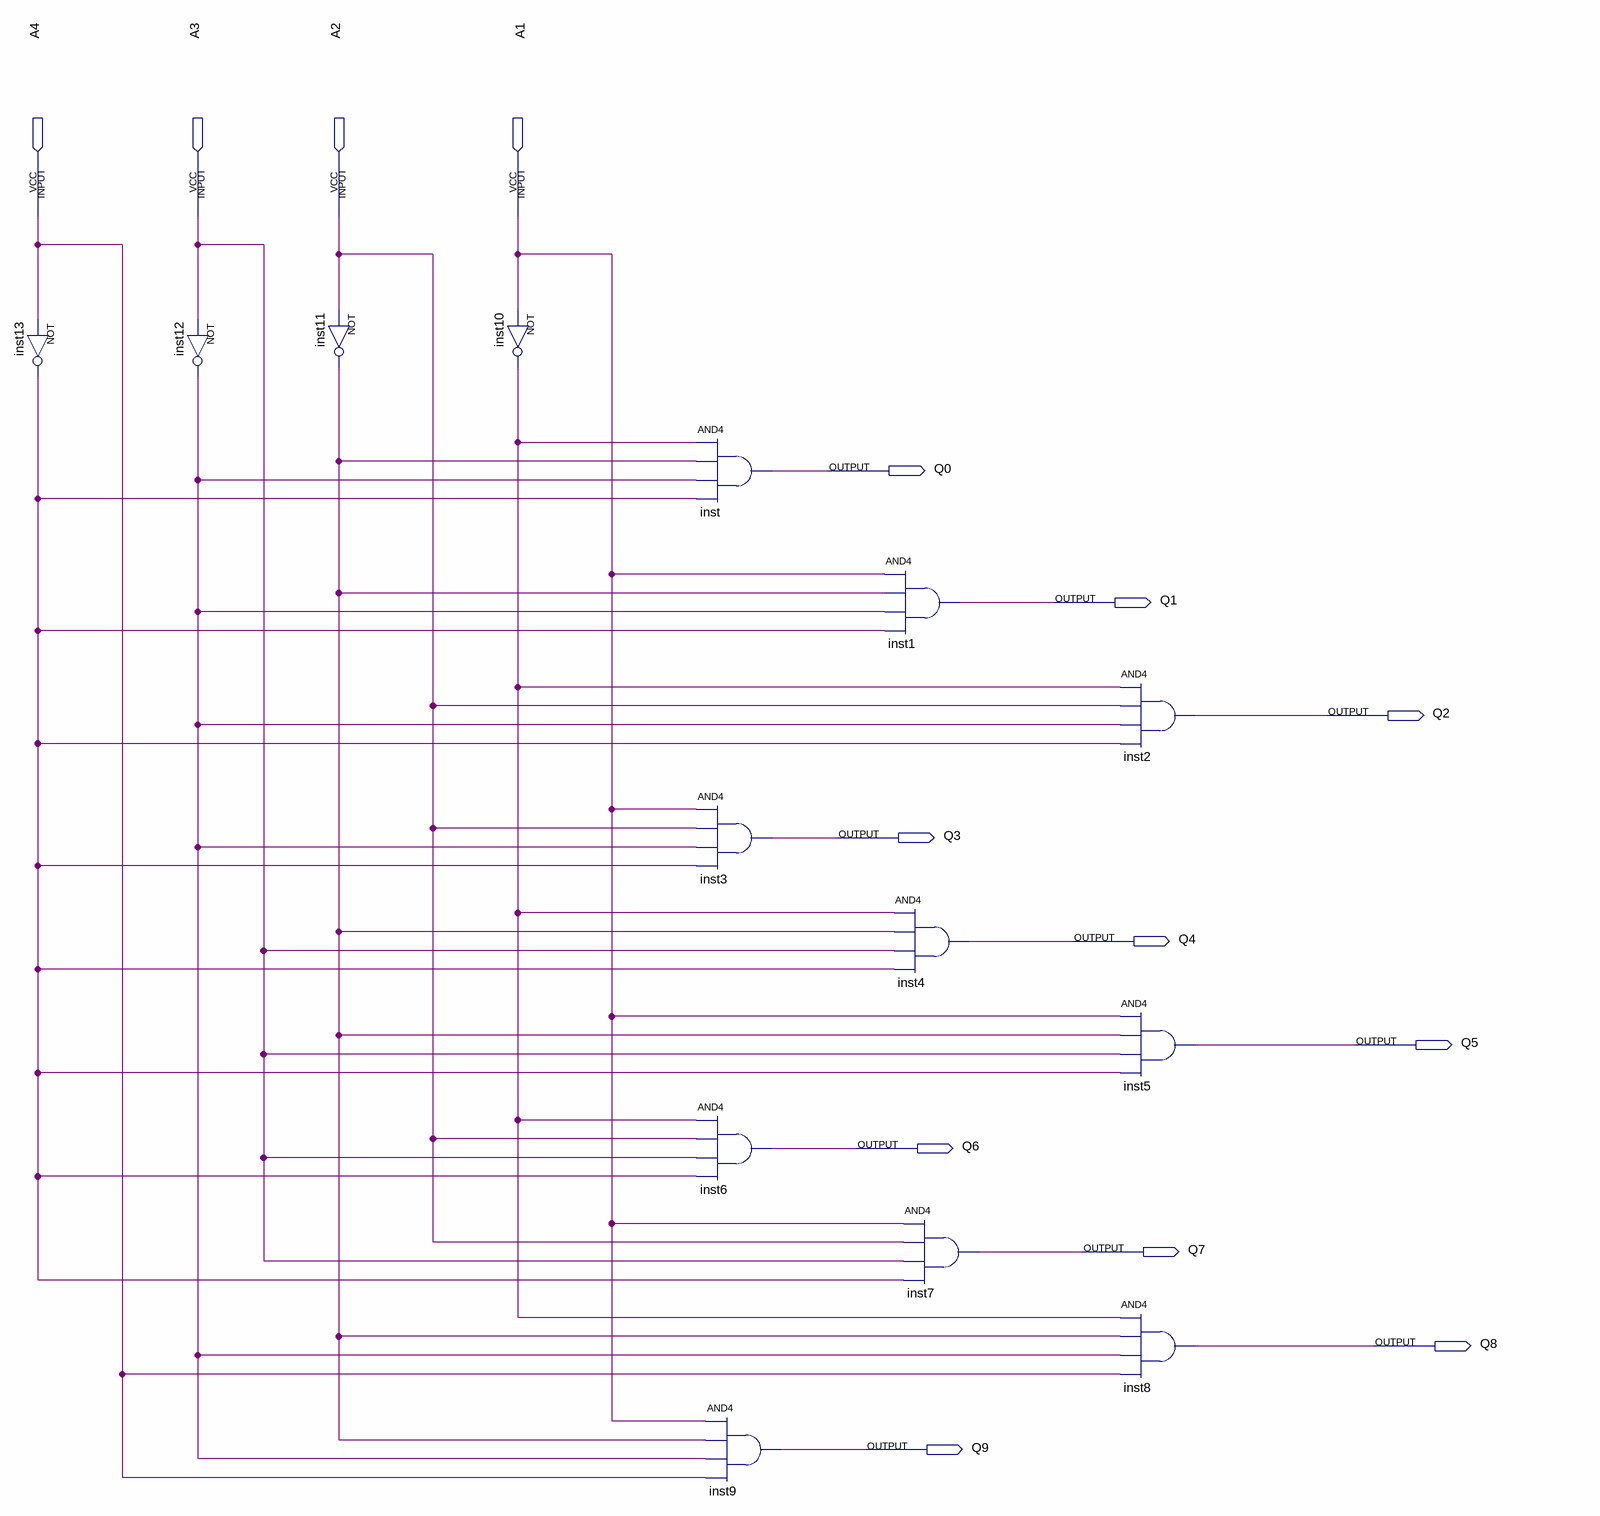
[diagram p0: schematic sheet]
// Quartus schematic BinToDecDecoder.bdf as structural Verilog: 14 symbols, 14 pins
module BinToDecDecoder (
  input  A4,
  input  A3,
  input  A2,
  input  A1,
  output Q0,
  output Q1,
  output Q2,
  output Q3,
  output Q4,
  output Q5,
  output Q6,
  output Q7,
  output Q8,
  output Q9
);

  wire inst10_out, inst11_out, inst12_out, inst13_out;

  not inst13 (inst13_out, A4);
  not inst12 (inst12_out, A3);
  not inst11 (inst11_out, A2);
  not inst10 (inst10_out, A1);
  and inst (Q0, inst10_out, inst11_out, inst12_out, inst13_out);
  and inst3 (Q3, A1, A2, inst12_out, inst13_out);
  and inst6 (Q6, inst10_out, A2, A3, inst13_out);
  and inst9 (Q9, A1, inst11_out, inst12_out, A4);
  and inst1 (Q1, A1, inst11_out, inst12_out, inst13_out);
  and inst4 (Q4, inst10_out, inst11_out, A3, inst13_out);
  and inst7 (Q7, A1, A2, A3, inst13_out);
  and inst2 (Q2, inst10_out, A2, inst12_out, inst13_out);
  and inst5 (Q5, A1, inst11_out, A3, inst13_out);
  and inst8 (Q8, inst10_out, inst11_out, inst12_out, A4);
endmodule
